# Altium schematic sheet PERSEUS.SchDoc
size A4; SheetNumber: 1; SheetTotal: 7
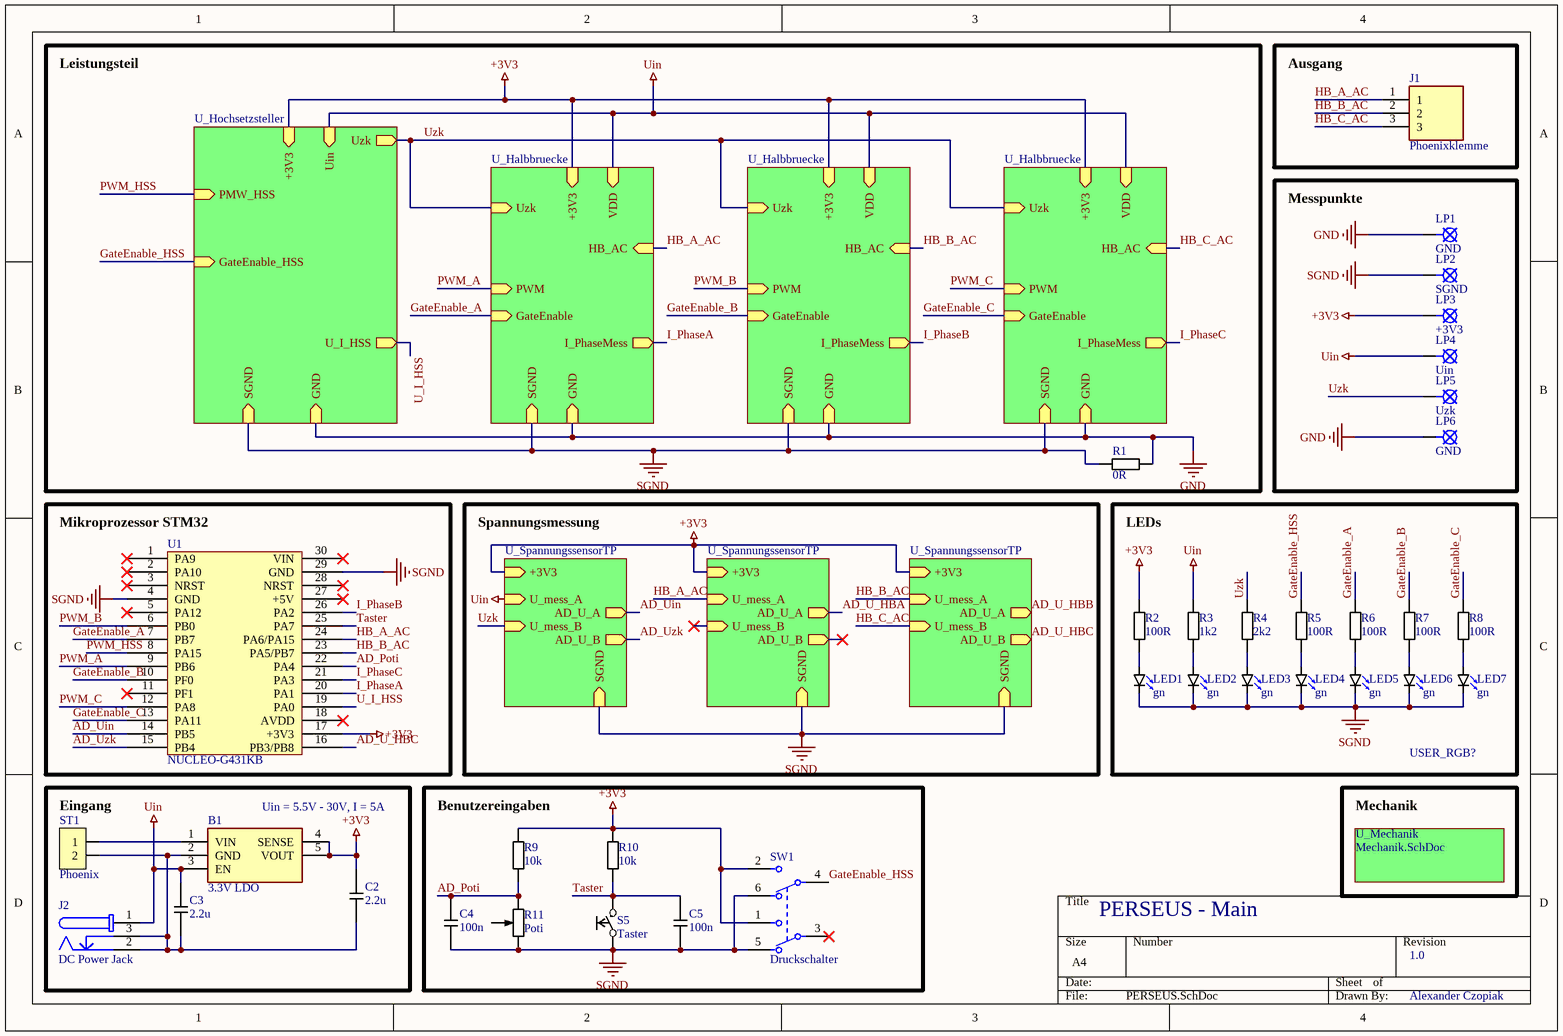
[diagram p0: PERSEUS.SchDoc]

## Parts
B1  3.3V LDO  [SOT95P280X100-5N]
C2  2.2u  [1206_C]
C3  2.2u  [1206_C]
C4  100n  [1206_C]
C5  100n  [1206_C]
J1  Phoenixklemme  [Phoenix_3er]
J2  DC Power Jack  [694106301002]
LED1  gn  [0805_DI_gr]
LED2  gn  [0805_DI_gr]
LED3  gn  [0805_DI_gr]
LED4  gn  [0805_DI_gr]
LED5  gn  [0805_DI_gr]
LED6  gn  [0805_DI_gr]
LED7  gn  [0805_DI_gr]
LP1  GND  [LP1]
LP2  SGND  [LP1]
LP3  +3V3  [LP1]
LP4  Uin  [LP1]
LP5  Uzk  [LP1]
LP6  GND  [LP1]
R1  0R  [1206_R]
R2  100R  [1206_R]
R3  1k2  [1206_R]
R4  2k2  [1206_R]
R5  100R  [1206_R]
R6  100R  [1206_R]
R7  100R  [1206_R]
R8  100R  [1206_R]
R9  10k  [1206_R]
R10  10k  [1206_R]
R11  Poti  [POT_T607_3D]
S5  Taster  [TASTERSMD_3D]
ST1  Phoenix  [MKDS 1,5/ 2]
SW1  Druckschalter  [FP-ESB-33133-MFG]
U1  NUCLEO-G431KB  [NUCLEO-G431KB]

## Blocks framed on the sheet
Leistungsteil: R1
Ausgang: J1
Messpunkte: LP1-LP6
Mikroprozessor STM32: U1
LEDs: LED1-LED7 R2-R8
Eingang: B1 C2 C3 J2 ST1
Benutzereingaben: C4 C5 R9-R11 S5 SW1

## Sub-sheets
U_Halbbruecke = Halbbruecke.SchDoc: HB_AC (in), GND (in), I_PhaseMess (out), SGND (in), GateEnable (in), +3V3 (in), Uzk (in), VDD (in), PWM (in)
U_Halbbruecke = Halbbruecke.SchDoc: HB_AC (in), GND (in), I_PhaseMess (out), SGND (in), GateEnable (in), +3V3 (in), Uzk (in), VDD (in), PWM (in)
U_Halbbruecke = Halbbruecke.SchDoc: HB_AC (in), I_PhaseMess (out), GateEnable (in), Uzk (in), PWM (in), GND (in), SGND (in), +3V3 (in), VDD (in)
U_Hochsetzsteller = Hochsetzsteller.SchDoc: Uin (in), U_I_HSS (out), Uzk (out), PMW_HSS (in), GateEnable_HSS (in), GND (in), SGND (in), +3V3 (in)
U_Mechanik = Mechanik.SchDoc: no entries
U_SpannungssensorTP = SpannungssensorTP.SchDoc: AD_U_B (out), U_mess_B (in), SGND (in), AD_U_A (out), U_mess_A (in), +3V3 (in)
U_SpannungssensorTP = SpannungssensorTP.SchDoc: AD_U_B (out), U_mess_B (in), SGND (in), AD_U_A (out), U_mess_A (in), +3V3 (in)
U_SpannungssensorTP = SpannungssensorTP.SchDoc: AD_U_B (out), U_mess_B (in), SGND (in), AD_U_A (out), U_mess_A (in), +3V3 (in)

## Nets
+3V3: B1.4(SENSE) B1.5(VOUT) C2.2 LP3.1 R2.2 R9.2 R10.2 SW1.1(1_NO) SW1.2(2_NO) U1.17(+3V3) ; sheet U_Halbbruecke/+3V3, sheet U_Hochsetzsteller/+3V3, sheet U_Halbbruecke/+3V3, sheet U_Halbbruecke/+3V3, sheet U_SpannungssensorTP/+3V3, sheet U_SpannungssensorTP/+3V3, sheet U_SpannungssensorTP/+3V3
GND: LP1.1 LP6.1 R1.1 ; sheet U_Halbbruecke/GND, sheet U_Hochsetzsteller/GND, sheet U_Halbbruecke/GND, sheet U_Halbbruecke/GND
SGND: C4.1 C5.1 LED1.2(K) LED2.2(K) LED3.2(K) LED4.2(K) LED5.2(K) LED6.2(K) LED7.2(K) LP2.1 R1.2 R11.1 S5.2 SW1.5(1_NC) SW1.6(2_NC) U1.4(GND) U1.29(GND) ; sheet U_Halbbruecke/SGND, sheet U_Hochsetzsteller/SGND, sheet U_Halbbruecke/SGND, sheet U_Halbbruecke/SGND, sheet U_SpannungssensorTP/SGND, sheet U_SpannungssensorTP/SGND, sheet U_SpannungssensorTP/SGND
Uin: B1.3(EN) C3.2 J2.1 LP4.1 R3.2 ; sheet U_Halbbruecke/VDD, sheet U_Hochsetzsteller/Uin, sheet U_Halbbruecke/VDD, sheet U_Halbbruecke/VDD, sheet U_SpannungssensorTP/U_mess_A
AD_Poti: C4.2 R9.1 R11.2 U1.22(PA4)
AD_U_HBA: sheet U_SpannungssensorTP/AD_U_A
AD_U_HBB: sheet U_SpannungssensorTP/AD_U_A
AD_U_HBC: U1.16(PB3/PB8) ; sheet U_SpannungssensorTP/AD_U_B
AD_Uin: U1.14(PB5) ; sheet U_SpannungssensorTP/AD_U_A
AD_Uzk: U1.15(PB4) ; sheet U_SpannungssensorTP/AD_U_B
GateEnable_A: R6.2 U1.7(PB7) ; sheet U_Halbbruecke/GateEnable
GateEnable_B: R7.2 U1.10(PF0) ; sheet U_Halbbruecke/GateEnable
GateEnable_C: R8.2 U1.13(PA11) ; sheet U_Halbbruecke/GateEnable
GateEnable_HSS: R5.2 SW1.4(2_C) ; sheet U_Hochsetzsteller/GateEnable_HSS
HB_A_AC: J1.1 U1.24(PA6/PA15) ; sheet U_Halbbruecke/HB_AC, sheet U_SpannungssensorTP/U_mess_A
HB_B_AC: J1.2 U1.23(PA5/PB7) ; sheet U_Halbbruecke/HB_AC, sheet U_SpannungssensorTP/U_mess_A
HB_C_AC: J1.3 ; sheet U_Halbbruecke/HB_AC, sheet U_SpannungssensorTP/U_mess_B
I_PhaseA: U1.20(PA1) ; sheet U_Halbbruecke/I_PhaseMess
I_PhaseB: U1.26(PA2) ; sheet U_Halbbruecke/I_PhaseMess
I_PhaseC: U1.21(PA3) ; sheet U_Halbbruecke/I_PhaseMess
PWM_A: U1.9(PB6) ; sheet U_Halbbruecke/PWM
PWM_B: U1.6(PB0) ; sheet U_Halbbruecke/PWM
PWM_C: U1.12(PA8) ; sheet U_Halbbruecke/PWM
PWM_HSS: U1.8(PA15) ; sheet U_Hochsetzsteller/PMW_HSS
Taster: C5.2 R10.1 S5.1 U1.25(PA7)
U_I_HSS: U1.19(PA0) ; sheet U_Hochsetzsteller/U_I_HSS
Uzk: LP5.1 R4.2 ; sheet U_Halbbruecke/Uzk, sheet U_Hochsetzsteller/Uzk, sheet U_Halbbruecke/Uzk, sheet U_Halbbruecke/Uzk, sheet U_SpannungssensorTP/U_mess_B
NetB1_1: B1.1(VIN) ST1.1
NetB1_2: B1.2(GND) C2.1 C3.1 J2.2 J2.3 ST1.2
NetLED1_1: LED1.1(A) R2.1
NetLED2_1: LED2.1(A) R3.1
NetLED3_1: LED3.1(A) R4.1
NetLED4_1: LED4.1(A) R5.1
NetLED5_1: LED5.1(A) R6.1
NetLED6_1: LED6.1(A) R7.1
NetLED7_1: LED7.1(A) R8.1

Not connected (* = marked no-connect by the designer): R11 W(Abgriff); SW1 3(1_C)*; U1 1(PA9)* 2(PA10)* 3(NRST)* 5(PA12)* 11(PF1)* 18(AVDD)* 27(+5V)* 28(NRST)* 30(VIN)*

## Notes on the sheet
- Spannungsmessung
- USER_RGB?
- (near B1) Uin = 5.5V - 30V, I = 5A
- Mechanik
- PERSEUS - Main
- 1.0
- Alexander Czopiak

## Library data of the parts
B1 = Spannungsregler: 40V, 200mA, Low Noise, CMOS LDO Linear Regulator, ADPL44002AUJZ-3.3-R7; Manufacturer_Name: Analog Devices; Geometry.Height: 1mm; Mouser Part Number: 584-PL44002AUJZ33R7; Mouser Price/Stock: https://www.mouser.co.uk/ProductDetail/Analog-Devices/ADPL44002AUJZ-3.3-R7?qs=%252BXxaIXUDbq3bLG2Aqffs8Q%3D%3D; Manufacturer_Part_Number: ADPL44002AUJZ-3.3-R7; Datasheet Link: https://www.analog.com/ADPL44002/datasheet
C2 C3 = CAP: Min 2.2uF
C4 C5 = CAP: Kondensator (ohne Polarität)
J1 = Leiterbahnklemme: Phoenix: Fixed Terminal Blocks 3P 7.5mm GMKDS 1,5/ 3; Manufacturer_Name: Phoenix Contact; Manufacturer_Part_Number: 1717033; Geometry.Height: 13.9mm; Mouser Part Number: 651-1717033; Mouser Price/Stock: https://www.mouser.co.uk/ProductDetail/Phoenix-Contact/1717033?qs=aYsvlkyO7qPHPfcN%252B81Plg%3D%3D; Arrow Part Number: 1717033; Arrow Price/Stock: https://www.arrow.com/en/products/1717033/phoenix-contact?utm_currency=USD&region=nac; Datasheet Link: https://media.digikey.com/pdf/Data%20Sheets/Phoenix%20Contact%20PDFs/1717033.pdf
J2 = CMP-1502-00188-2: NexarPartId: 52676100; Voltage Rating (DC): 20V; Gender: Male; Voltage Rating: 24V; Insulation Resistance: 100MΩ; Current Rating: 5A; Shielding: Unshielded; Number of Contacts: 3; Color: Black; Housing Material: Polyamide; Contact Gender: Female; Connector Type: Power; REACH SVHC: Unknown; Termination: Through Hole; Height: 11mm; RoHS: Compliant; Mount: Through Hole; Flammability Rating: UL94 V-0; Packaging: Bulk; Min Operating Temperature: -40°C; Contact Plating: Tin; Max Operating Temperature: 85°C; Operating Supply Voltage: 24V; Contact Material: Gold, Tin
LED1-LED7 = LED SMD 0805: LED SMD 0805 (gruen)
LP1-LP6 = LP
R1 R2 R7 R8 = WIDERSTAND: LED Vorwiderstand: Min 65 Ohm, Berechnet für 3.3V, 2V Spannungsabfall, 20mA Strom
R3 R9 R10 = WIDERSTAND: LED Vorwiderstand: Min 1.4 kOhm Berechnet für 30V Uin und 2 V Spannungsabfall und If=20mA
R4-R6 = WIDERSTAND
R11 = POT: Widerstand
S5 = TASTER-SMD
ST1 = CONN02: Phönix-Klemme
SW1 = CMP-05613-000004-1: SWITCH PUSH DPDT 0.2A 14V; Switch Function: On-On; Contact Current Rating: 200mA; Actuator Type: Lever; Mount: Through Hole; Voltage Rating (DC): 14V; Package Quantity: 100; Orientation: Vertical; RoHS Compliant: Yes; Contact Plating: Silver; Packaging: Bulk; Radiation Hardening: No; Throw Configuration: DPDT; Termination: PC Pin; REACH SVHC: No SVHC; Max Operating Temperature: 80°C; Min Operating Temperature: -30°C; Lead Free: Lead Free; Current Rating: 200mA; Series: ESB33; Width: 10mm; Length: 10mm